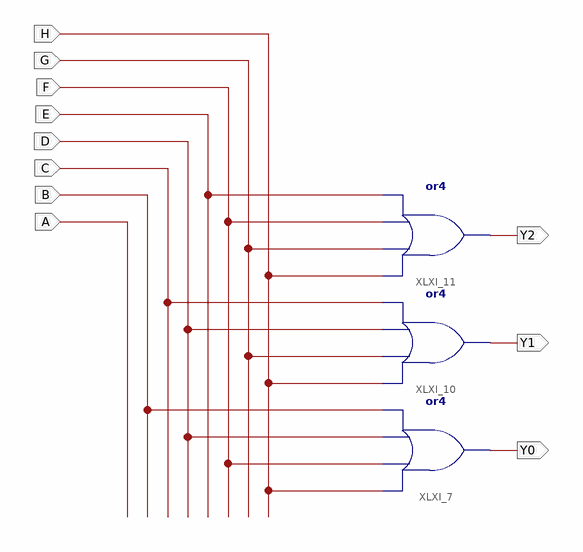
[diagram p0: schematic sheet 1]
// Xilinx ISE schematic onehot_encoder_8.sch (zynq) as structural Verilog: 3 symbols, 11 ports
module onehot_encoder_8 (
  input  H,
  input  G,
  input  F,
  input  E,
  input  A,
  input  C,
  input  D,
  input  B,
  output Y0,
  output Y1,
  output Y2
);

  or XLXI_7 (Y0, H, F, D, B);
  or XLXI_10 (Y1, H, G, D, C);
  or XLXI_11 (Y2, H, G, F, E);
endmodule
